# EAGLE schematic panda (EAGLE 7.6.0)
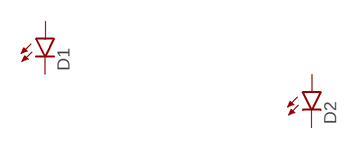
[diagram p0: schematic, sheet 1]

## Parts
D1  LED-3MM-NO_SILK  [LED3MM-NS]
D2  LED-3MM-NO_SILK  [LED3MM-NS]
Unconnected: D1.A D1.K(C) D2.A D2.K(C)

## Library data of the parts
D1 D2 = SparkFun-LED:LED: LEDs Standard schematic elements and footprints for 5mm, 3mm, 1206, and 0603 sized LEDs. 5mm - Spark Fun Electronics SKU : COM-00529 (and others)